# EAGLE design MotherboardThin (EAGLE 9.4.2)
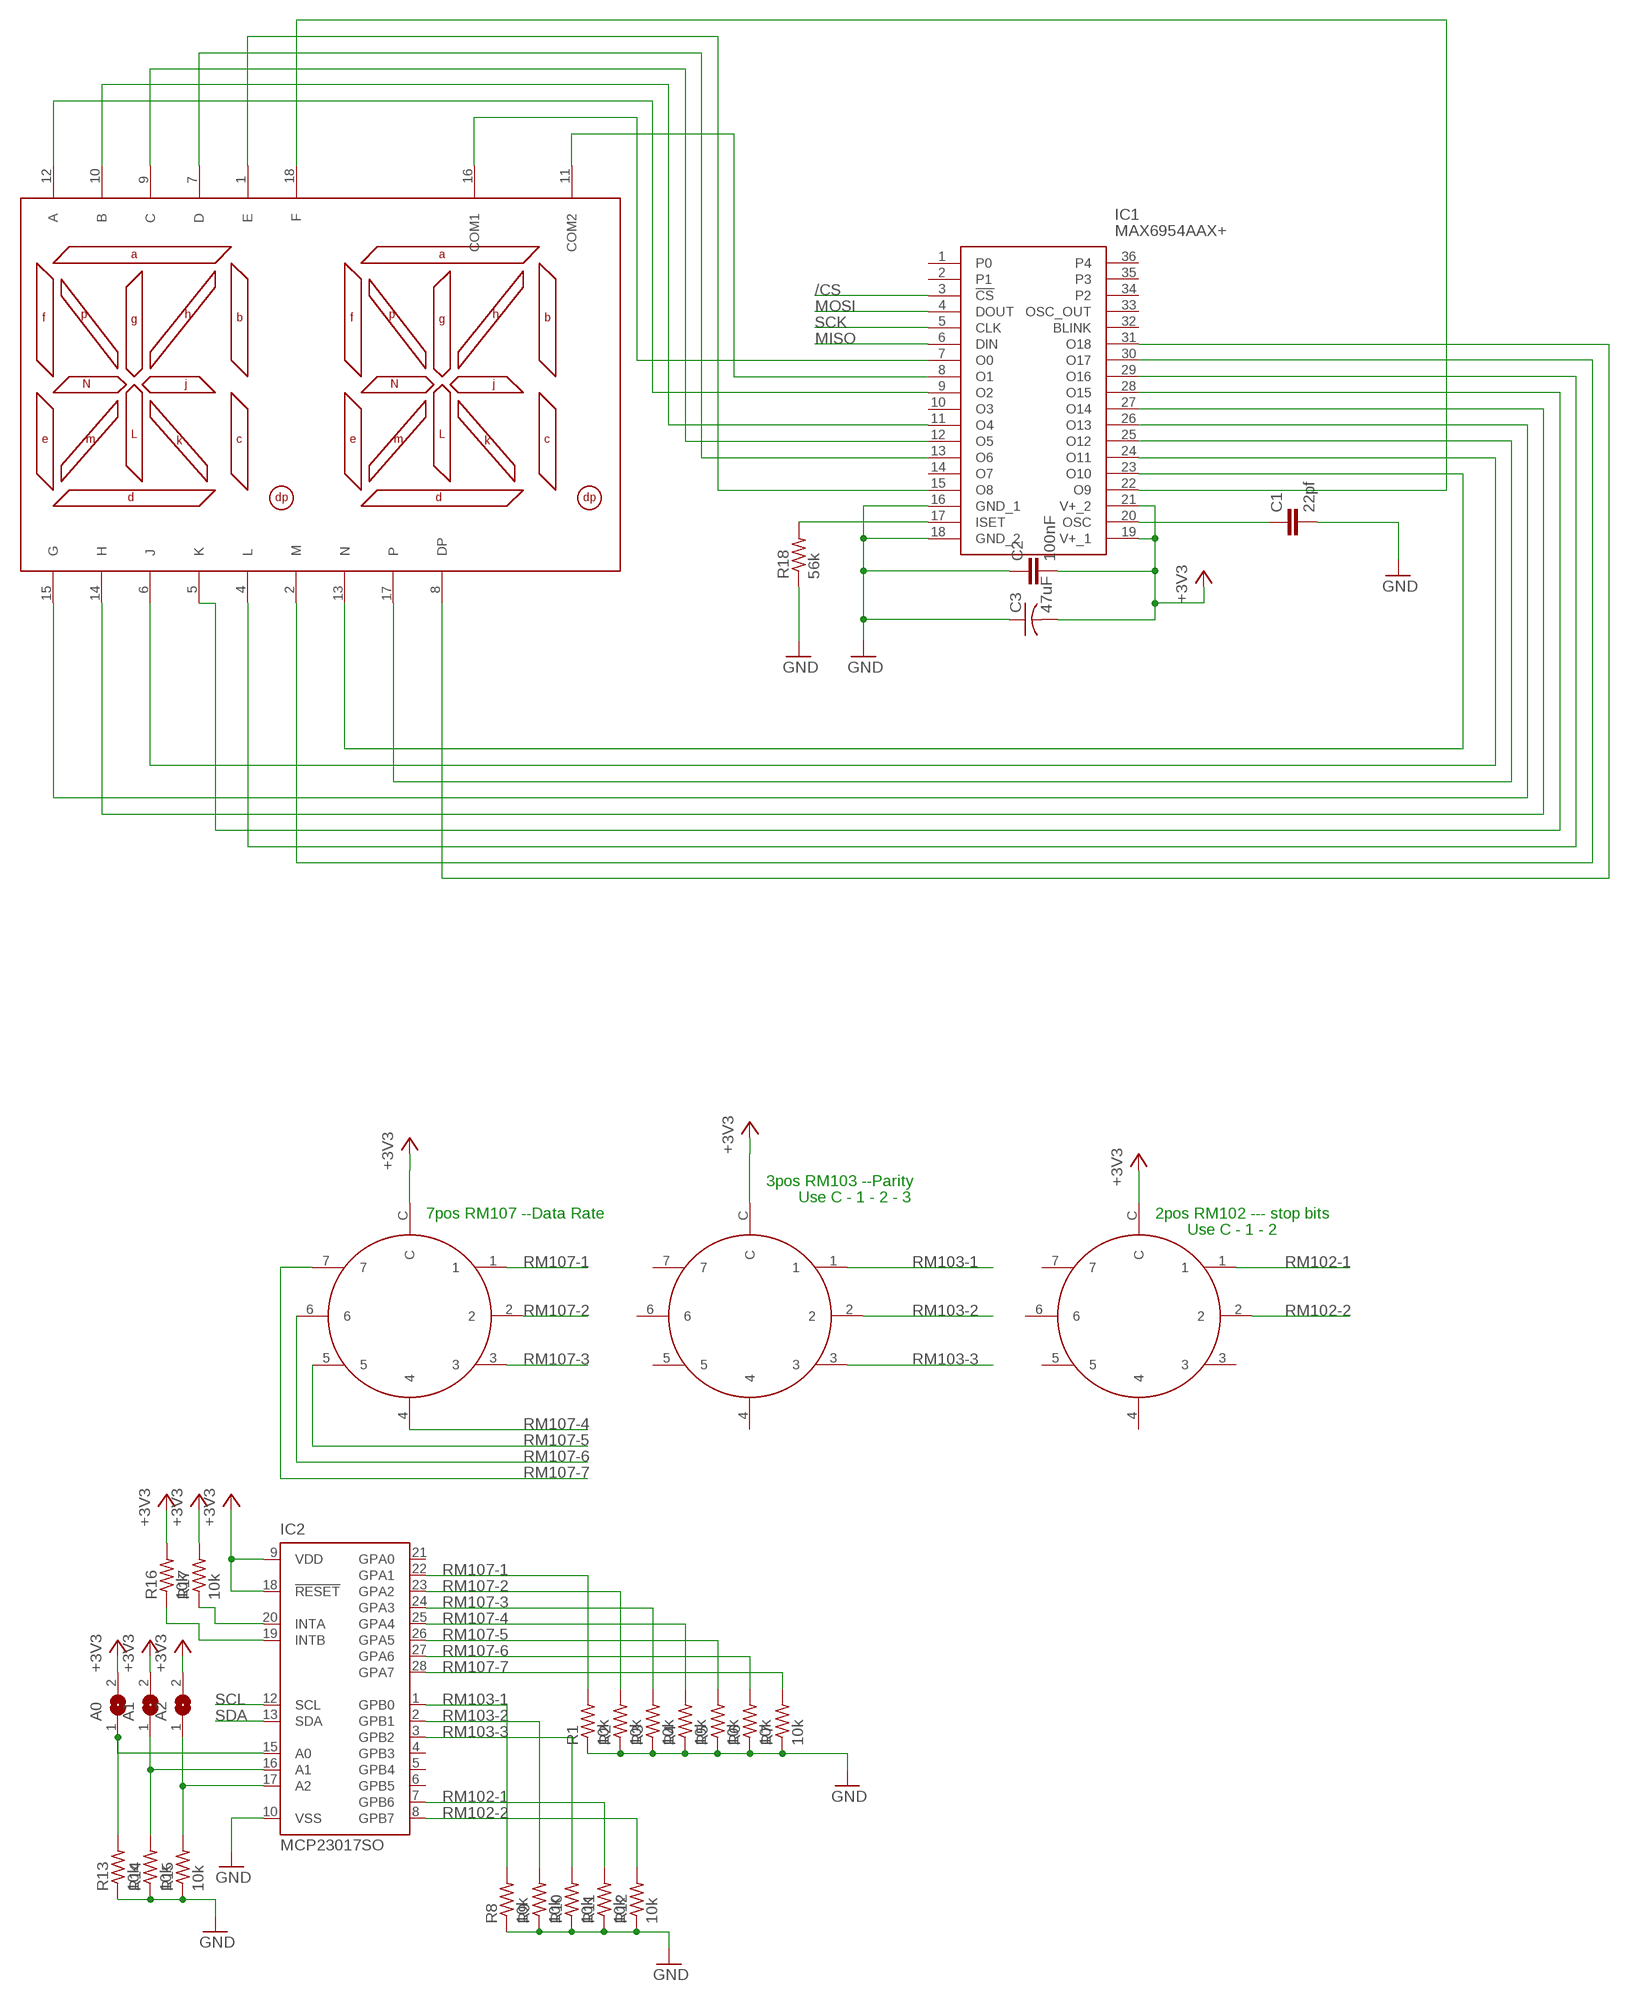
[diagram p0: schematic, sheet 1, part 1 of 2]
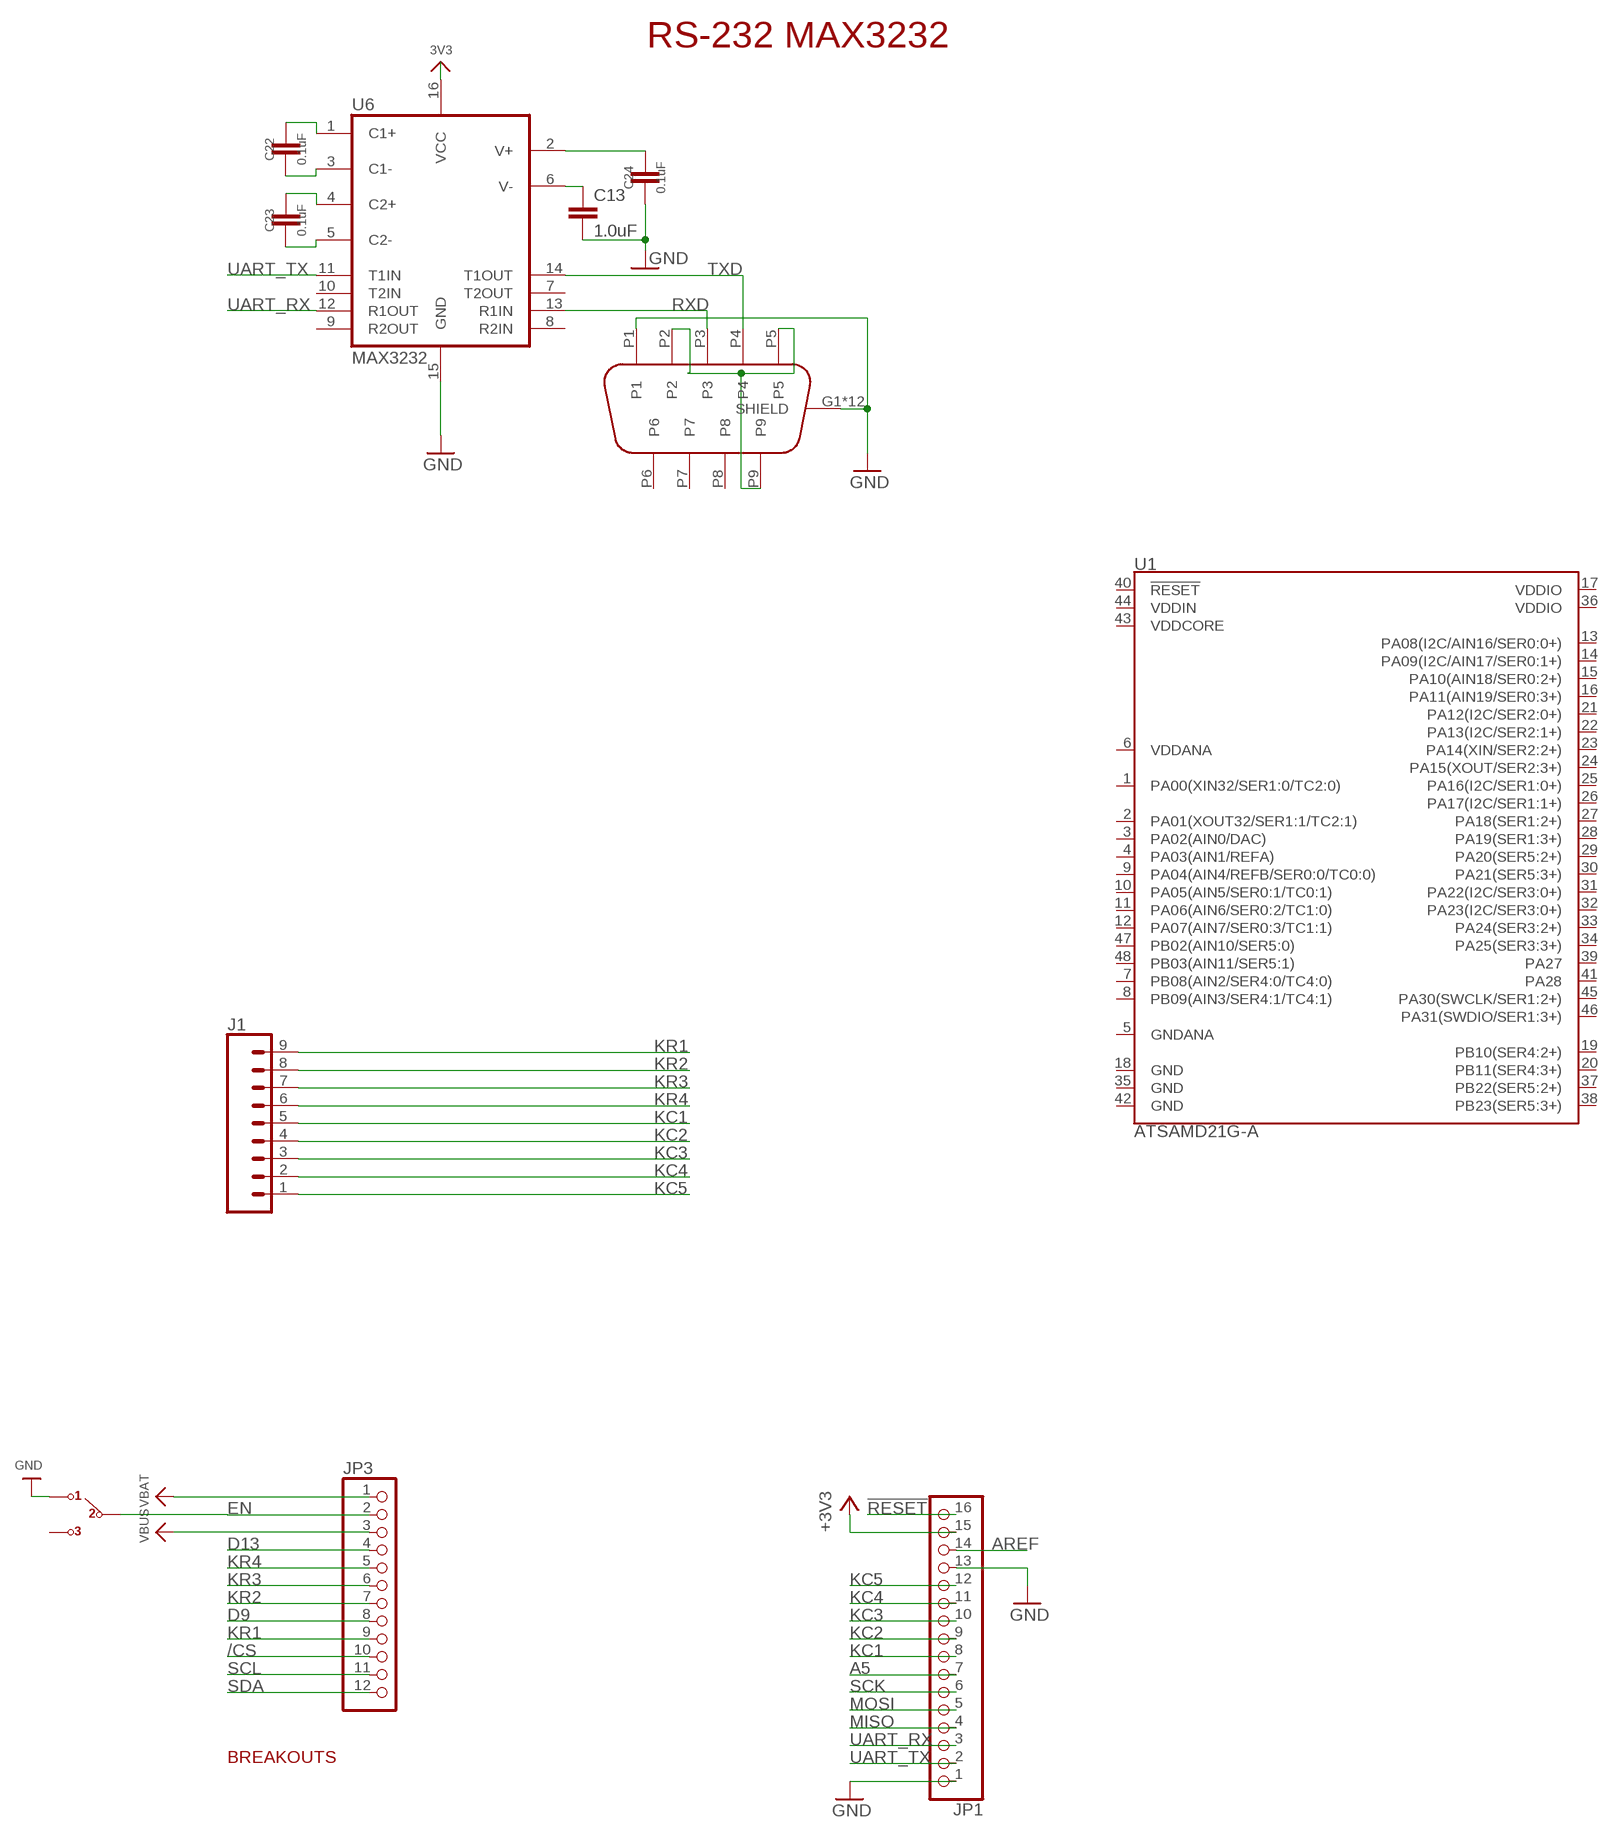
[diagram p1: schematic, sheet 1, part 2 of 2]

## Parts
A0  SJ  [SJ]
A1  SJ  [SJ]
A2  SJ  [SJ]
C1  22pf  1.0UF-0805-25V-(+80/-20%)  [0805]
C2  100nF  1.0UF-0805-25V-(+80/-20%)  [0805]
C3  47uF  C-USC1206  [C1206]
C13  1.0uF  1.0UF-0805-25V-10%  [0805]
C22  0.1uF  1.0UF-0805-25V-10%  [0805]
C23  0.1uF  1.0UF-0805-25V-10%  [0805]
C24  0.1uF  1.0UF-0805-25V-10%  [0805]
DE9FEMALE  EDGEMOUNTDE9  [DE09S065TLF]
IC1  MAX6954AAX+  [SOP80P1030X264-36N]
IC2  MCP23017SO  [SO28W]
J1  CONN_09  [1X09]
JP1  HEADER-1X16ROUND  [1X16_ROUND]
JP3  HEADER-1X12  [1X12_ROUND]
R1  10k  R-US_M0805  [M0805]
R2  10k  R-US_M0805  [M0805]
R3  10k  R-US_M0805  [M0805]
R4  10k  R-US_M0805  [M0805]
R5  10k  R-US_M0805  [M0805]
R6  10k  R-US_M0805  [M0805]
R7  10k  R-US_M0805  [M0805]
R8  10k  R-US_M0805  [M0805]
R9  10k  R-US_M0805  [M0805]
R10  10k  R-US_M0805  [M0805]
R11  10k  R-US_M0805  [M0805]
R12  10k  R-US_M0805  [M0805]
R13  10k  R-US_M0805  [M0805]
R14  10k  R-US_M0805  [M0805]
R15  10k  R-US_M0805  [M0805]
R16  10k  R-US_M0805  [M0805]
R17  10k  R-US_M0805  [M0805]
R18  56k  R-US_M0805  [M0805]
U1  ATSAMD21G-A  [TQFP-48]
U6  MAX3232  MAX2323SOIC16  [SO16]
U$1  HDSP-A27C  [DIP-18]
U$2  RM107772BCB  [RM107772BCB]
U$3  RM107772BCB  [RM107772BCB]
U$5  OS102011MA1QN1  [OS102011MA1QN1]
U$6  RM107772BCB  [RM107772BCB]

## Nets
3V3: U6.16(VCC)
!RESET: JP1.16
+3V3: A0.2 A1.2 A2.2 C2.2 C3.2 IC1.19(V+_1) IC1.21(V+_2) IC2.9(VDD) IC2.18(!RESET) JP1.15 R16.2 R17.2 U$2.C U$3.C U$6.C
/CS: IC1.3(!CS) JP3.10
A5: JP1.7
AREF: JP1.14
D9: JP3.8
D13: JP3.4
EN: JP3.2 U$5.P$2
GND: C1.2 C2.1 C3.1 C13.2 C24.2 DE9FEMALE.G1(SHIELD) DE9FEMALE.G2(SHIELD) DE9FEMALE.G3(SHIELD) DE9FEMALE.G4(SHIELD) DE9FEMALE.G5(SHIELD) DE9FEMALE.G6(SHIELD) DE9FEMALE.G7(SHIELD) DE9FEMALE.G8(SHIELD) DE9FEMALE.G9(SHIELD) DE9FEMALE.G10(SHIELD) DE9FEMALE.G11(SHIELD) DE9FEMALE.G12(SHIELD) DE9FEMALE.P1 IC1.16(GND_1) IC1.18(GND_2) IC2.10(VSS) JP1.1 JP1.13 R1.1 R2.1 R3.1 R4.1 R5.1 R6.1 R7.1 R8.1 R9.1 R10.1 R11.1 R12.1 R13.1 R14.1 R15.1 R18.1 U6.15(GND) U$5.P$1
KC1: J1.5 JP1.8
KC2: J1.4 JP1.9
KC3: J1.3 JP1.10
KC4: J1.2 JP1.11
KC5: J1.1 JP1.12
KR1: J1.9 JP3.9
KR2: J1.8 JP3.7
KR3: J1.7 JP3.6
KR4: J1.6 JP3.5
MISO: IC1.6(DIN) JP1.4
MOSI: IC1.4(DOUT) JP1.5
N$1: IC1.7(O0) U$1.16(COM1)
N$2: IC1.9(O2) U$1.12(A)
N$3: IC1.11(O4) U$1.10(B)
N$4: IC1.12(O5) U$1.9(C)
N$5: IC1.13(O6) U$1.7(D)
N$6: IC1.15(O8) U$1.1(E)
N$7: IC1.22(O9) U$1.18(F)
N$8: IC1.23(O10) U$1.13(N)
N$9: IC1.24(O11) U$1.6(J)
N$10: IC1.25(O12) U$1.17(P)
N$11: IC1.26(O13) U$1.15(G)
N$12: IC1.27(O14) U$1.14(H)
N$13: IC1.28(O15) U$1.5(K)
N$14: IC1.29(O16) U$1.4(L)
N$15: IC1.30(O17) U$1.2(M)
N$16: IC1.31(O18) U$1.8(DP)
N$17: IC1.8(O1) U$1.11(COM2)
N$18: C22.2 U6.3(C1-)
N$19: C22.1 U6.1(C1+)
N$20: C23.1 U6.4(C2+)
N$21: C23.2 U6.5(C2-)
N$22: C24.1 U6.2(V+)
N$23: C13.1 U6.6(V-)
N$24: DE9FEMALE.P2 DE9FEMALE.P5 DE9FEMALE.P9
N$25: A0.1 IC2.15(A0) R13.2
N$26: A1.1 IC2.16(A1) R14.2
N$27: A2.1 IC2.17(A2) R15.2
N$28: IC2.19(INTB) R16.1
N$29: IC2.20(INTA) R17.1
N$30: C1.1 IC1.20(OSC)
N$31: IC1.17(ISET) R18.2
RM102-1: IC2.7(GPB6) R11.2 U$6.1
RM102-2: IC2.8(GPB7) R12.2 U$6.2
RM103-1: IC2.1(GPB0) R8.2 U$3.1
RM103-2: IC2.2(GPB1) R9.2 U$3.2
RM103-3: IC2.3(GPB2) R10.2 U$3.3
RM107-1: IC2.22(GPA1) R1.2 U$2.1
RM107-2: IC2.23(GPA2) R2.2 U$2.2
RM107-3: IC2.24(GPA3) R3.2 U$2.3
RM107-4: IC2.25(GPA4) R4.2 U$2.4
RM107-5: IC2.26(GPA5) R5.2 U$2.5
RM107-6: IC2.27(GPA6) R6.2 U$2.6
RM107-7: IC2.28(GPA7) R7.2 U$2.7
RXD: DE9FEMALE.P3 U6.13(R1IN)
SCK: IC1.5(CLK) JP1.6
SCL: IC2.12(SCL) JP3.11
SDA: IC2.13(SDA) JP3.12
TXD: DE9FEMALE.P4 U6.14(T1OUT)
UART_RX: JP1.3 U6.12(R1OUT)
UART_TX: JP1.2 U6.11(T1IN)
VBAT: JP3.1
VBUS: JP3.3
Unconnected: DE9FEMALE.P6 DE9FEMALE.P7 DE9FEMALE.P8 IC1.1(P0) IC1.2(P1) IC1.10(O3) IC1.14(O7) IC1.32(BLINK) IC1.33(OSC_OUT) IC1.34(P2) IC1.35(P3) IC1.36(P4) IC2.4(GPB3) IC2.5(GPB4) IC2.6(GPB5) IC2.21(GPA0) U1.1(PA00(XIN32/SER1:0/TC2:0)) U1.2(PA01(XOUT32/SER1:1/TC2:1)) U1.3(PA02(AIN0/DAC)) U1.4(PA03(AIN1/REFA)) U1.5(GNDANA) U1.6(VDDANA) U1.7(PB08(AIN2/SER4:0/TC4:0)) U1.8(PB09(AIN3/SER4:1/TC4:1)) U1.9(PA04(AIN4/REFB/SER0:0/TC0:0)) U1.10(PA05(AIN5/SER0:1/TC0:1)) U1.11(PA06(AIN6/SER0:2/TC1:0)) U1.12(PA07(AIN7/SER0:3/TC1:1)) U1.13(PA08(I2C/AIN16/SER0:0+)) U1.14(PA09(I2C/AIN17/SER0:1+)) U1.15(PA10(AIN18/SER0:2+)) U1.16(PA11(AIN19/SER0:3+)) U1.17(VDDIO) U1.18(GND) U1.19(PB10(SER4:2+)) U1.20(PB11(SER4:3+)) U1.21(PA12(I2C/SER2:0+)) U1.22(PA13(I2C/SER2:1+)) U1.23(PA14(XIN/SER2:2+)) U1.24(PA15(XOUT/SER2:3+)) U1.25(PA16(I2C/SER1:0+)) U1.26(PA17(I2C/SER1:1+)) U1.27(PA18(SER1:2+)) U1.28(PA19(SER1:3+)) U1.29(PA20(SER5:2+)) U1.30(PA21(SER5:3+)) U1.31(PA22(I2C/SER3:0+)) U1.32(PA23(I2C/SER3:0+)) U1.33(PA24(SER3:2+)) U1.34(PA25(SER3:3+)) U1.35(GND) U1.36(VDDIO) U1.37(PB22(SER5:2+)) U1.38(PB23(SER5:3+)) U1.39(PA27) U1.40(!RESET!) U1.41(PA28) U1.42(GND) U1.43(VDDCORE) U1.44(VDDIN) U1.45(PA30(SWCLK/SER1:2+)) U1.46(PA31(SWDIO/SER1:3+)) U1.47(PB02(AIN10/SER5:0)) U1.48(PB03(AIN11/SER5:1)) U6.7(T2OUT) U6.8(R2IN) U6.9(R2OUT) U6.10(T2IN) U$3.4 U$3.5 U$3.6 U$3.7 U$5.CASE1(CASE) U$5.CASE2(CASE) U$5.P$3 U$6.3 U$6.4 U$6.5 U$6.6 U$6.7

## Notes on the sheet
- RS-232 MAX3232
- 3pos RM103 --Parity
- Use C - 1 - 2 - 3
- 7pos RM107 --Data Rate | 2pos RM102 --- stop bits
- Use C - 1 - 2
- BREAKOUTS

## Library data of the parts
A0 A1 A2 = jumper:SJ: SMD solder JUMPER
C1 C2 = SparkFun-Capacitors:1.0UF: 1µF ceramic capacitors A capacitor is a passive two-terminal electrical component used to store electrical energy temporarily in an electric field.; PROD_ID: CAP-11625; VALUE: 1.0uF
C3 = adafruit:C-US: CAPACITOR, American symbol
C13 = SparkFun-Capacitors:1.0UF: 1µF ceramic capacitors A capacitor is a passive two-terminal electrical component used to store electrical energy temporarily in an electric field.; PROD_ID: CAP-08064
C22-C24 = SparkFun-Capacitors:1.0UF: 1µF ceramic capacitors A capacitor is a passive two-terminal electrical component used to store electrical energy temporarily in an electric field.; PROD_ID: CAP-08064; VALUE: 1.0uF
DE9FEMALE = Serial:EDGEMOUNTDE9
IC1 = SamacSys_Parts:MAX6954AAX+: MAX6954AAX+, LED Display Driver, 16-Digits 128-Segments, 2.7 5.5 V, 36-Pin SSOP Source: Datasheet <https://componentsearchengine.com/Datasheets/1/MAX6954AAX .pdf>; DESCRIPTION: MAX6954AAX+, LED Display Driver, 16-Digits 128-Segments, 2.7 5.5 V, 36-Pin SSOP; HEIGHT: 2.64mm; MANUFACTURER_NAME: Maxim Integrated; MANUFACTURER_PART_NUMBER: MAX6954AAX+; MOUSER_PART_NUMBER: 700-MAX6954AAX; MOUSER_PRICE-STOCK: https://www.mouser.com/Search/Refine.aspx?Keyword=700-MAX6954AAX
IC2 = adafruit:MCP23017: http://ww1.microchip.com/downloads/en/DeviceDoc/21952a.pdf Source: http://ww1.microchip.com/downloads/en/DeviceDoc/21952a.pdf
J1 = SparkFun-Connectors:CONN_09: Multi connection point. Often used as Generic Header-pin footprint for 0.1 inch spaced/style header connections On any of the 0.1 inch spaced packages, you can populate with these: Break Away Headers - Straight <https://www.sparkfun.com/products/116> (PRT-00116) Break Away Male Headers - Right Angle <https://www.sparkfun.com/products/553> (PRT-00553) Female Headers <https://www.sparkfun.com/products/115> (PRT-00115) Break Away Headers - Machine Pin <https://www.sparkfun.com/products/117> (PRT-00117) Break Away Female Headers - Swiss Machine Pin <https://www.sparkfun.com/products/743> (PRT-00743) For SCREWTERMINALS and SPRING TERMINALS visit here: Screw Terimnals on SparkFun.com <https://www.sparkfun.com/search/results?term=Screw+Terminals> (5mm/3.5mm/2.54mm spacing) This device is also useful as a general connection point to wire up your design to another part of your project. Our various solder wires solder well into these plated through hole pads. Hook-Up Wire - Assortment (Stranded, 22 AWG) <https://www.sparkfun.com/products/11375> (PRT-11375) Hook-Up Wire - Assortment (Solid Core, 22 AWG) <https://www.sparkfun.com/products/11367> (PRT-11367) View the entire wire category on our website here <https://www.sparkfun.com/categories/141> Special notes: Molex polarized connector foot print use with SKU : PRT-08231 with associated crimp pins and housings. 1MM SMD Version SKU: PRT-10208 NOTES ON THE VARIANTS LOCK and LOCK_LONGPADS... This footprint was designed to help hold the alignment of a through-hole component (i.e. 6-pin header) while soldering it into place. You may notice that each hole has been shifted either up or down by 0.005 of an inch from it's more standard position (which is a perfectly straight line). This slight alteration caused the pins (the squares in the middle) to touch the edges of the holes. Because they are alternating, it causes a "brace" to hold the component in place. 0.005 has proven to be the perfect amount of "off-center" position when using our standard breakaway headers. Although looks a little odd when you look at the bare footprint, once you have a header in there, the alteration is very hard to notice. Also,if you push a header all the way into place, it is covered up entirely on the bottom side.
JP1 = microbuilder:HEADER-1X16: PIN HEADER
JP3 = microbuilder:HEADER-1X12
R1-R18 = resistor:R-US_: RESISTOR, American symbol
U1 = SparkFun-IC-Microcontroller:ATSAMD21G: Atmel SAMD21G SMART ARM-Based Microcontroller The Atmel ® | SMART ™ SAM D21 is a series of low-power microcontrollers using the 32-bit ARM ® Cortex ® -M0+ processor, and ranging from 32- to 64-pins with up to 256KB Flash and 32KB of SRAM. The SAM D21 devices operate at a maximum frequency of 48MHz and reach 2.46 CoreMark/MHz. They are designed for simple and intuitive migration with identical peripheral modules, hex compatible code, identical linear address map and pin compatible migration paths between all devices in the product series. All devices include intelligent and flexible peripherals, Atmel Event System for inter-peripheral signaling, and support for capacitive touch button, slider and wheel user interfaces. Datasheet <https://cdn.sparkfun.com/datasheets/Dev/Arduino/Boards/Atmel-42181-SAM-D21_Datasheet.pdf> SparkFun Products SparkFun SAMD21 Mini Breakout <https://www.sparkfun.com/products/13664> (DEV-13664) SparkFun SAMD21 Dev Breakout <https://www.sparkfun.com/products/13672> (DEV-13672); PROD_ID: IC-13064
U6 = SparkFun-IC-Comms:MAX2323: RS232 Transceiver This part covers 232 drivers that are compatible with the MAX3232. Sipex SP3232EB Datasheet <http://cdn.sparkfun.com/datasheets/Components/General%20IC/SP3232EBCA-L.pdf> SparkFun Products SOIC component <https://www.sparkfun.com/products/589> (COM-00589 / IC-08171) Retired DIP component (COM-00316 / IC-08446) SparkFun Transceiver Breakout - MAX3232 <https://www.sparkfun.com/products/11189> (BOB-11189) SparkFun XBee Explorer Serial <https://www.sparkfun.com/products/13225> (WRL-13225); PROD_ID: IC-08171
U$1 = Segment displays:HDSP-A27C
U$2 U$3 U$6 = Segment displays:RM107772BCB
U$5 = FPC:OS102011MA1QN1

## Board
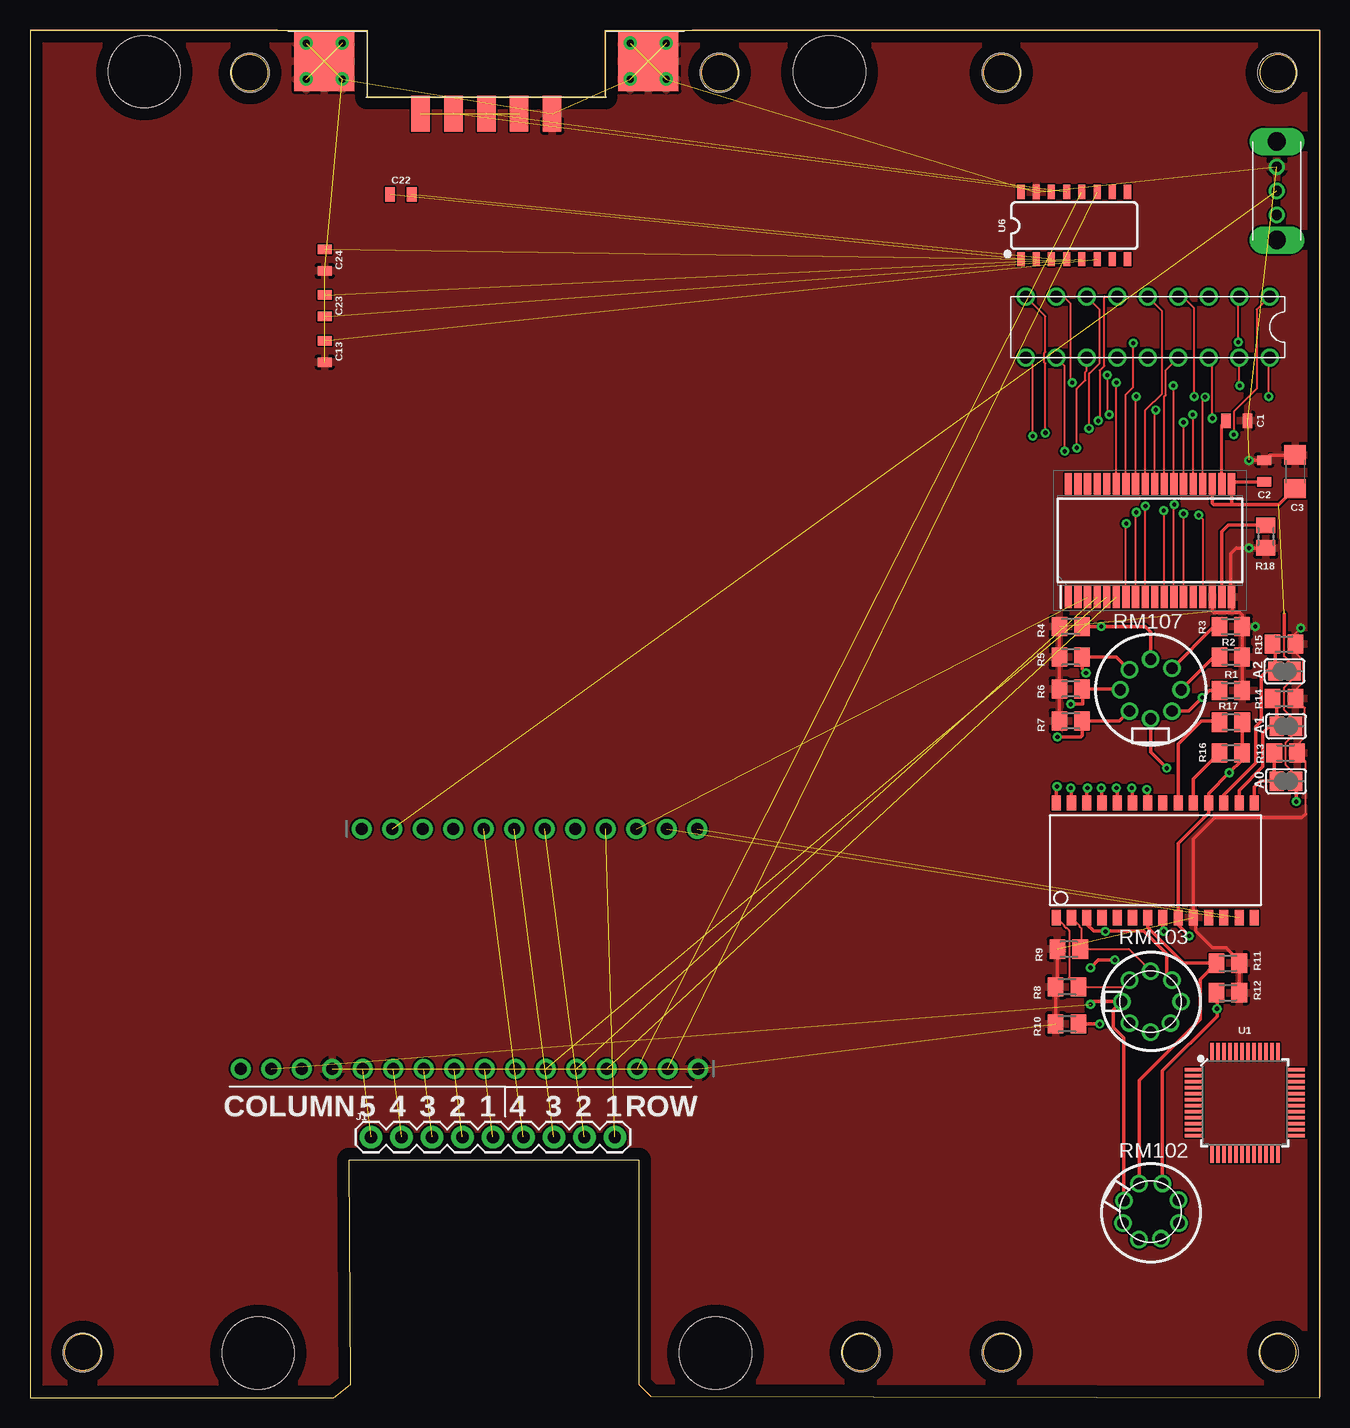
[diagram p2: board, top side]
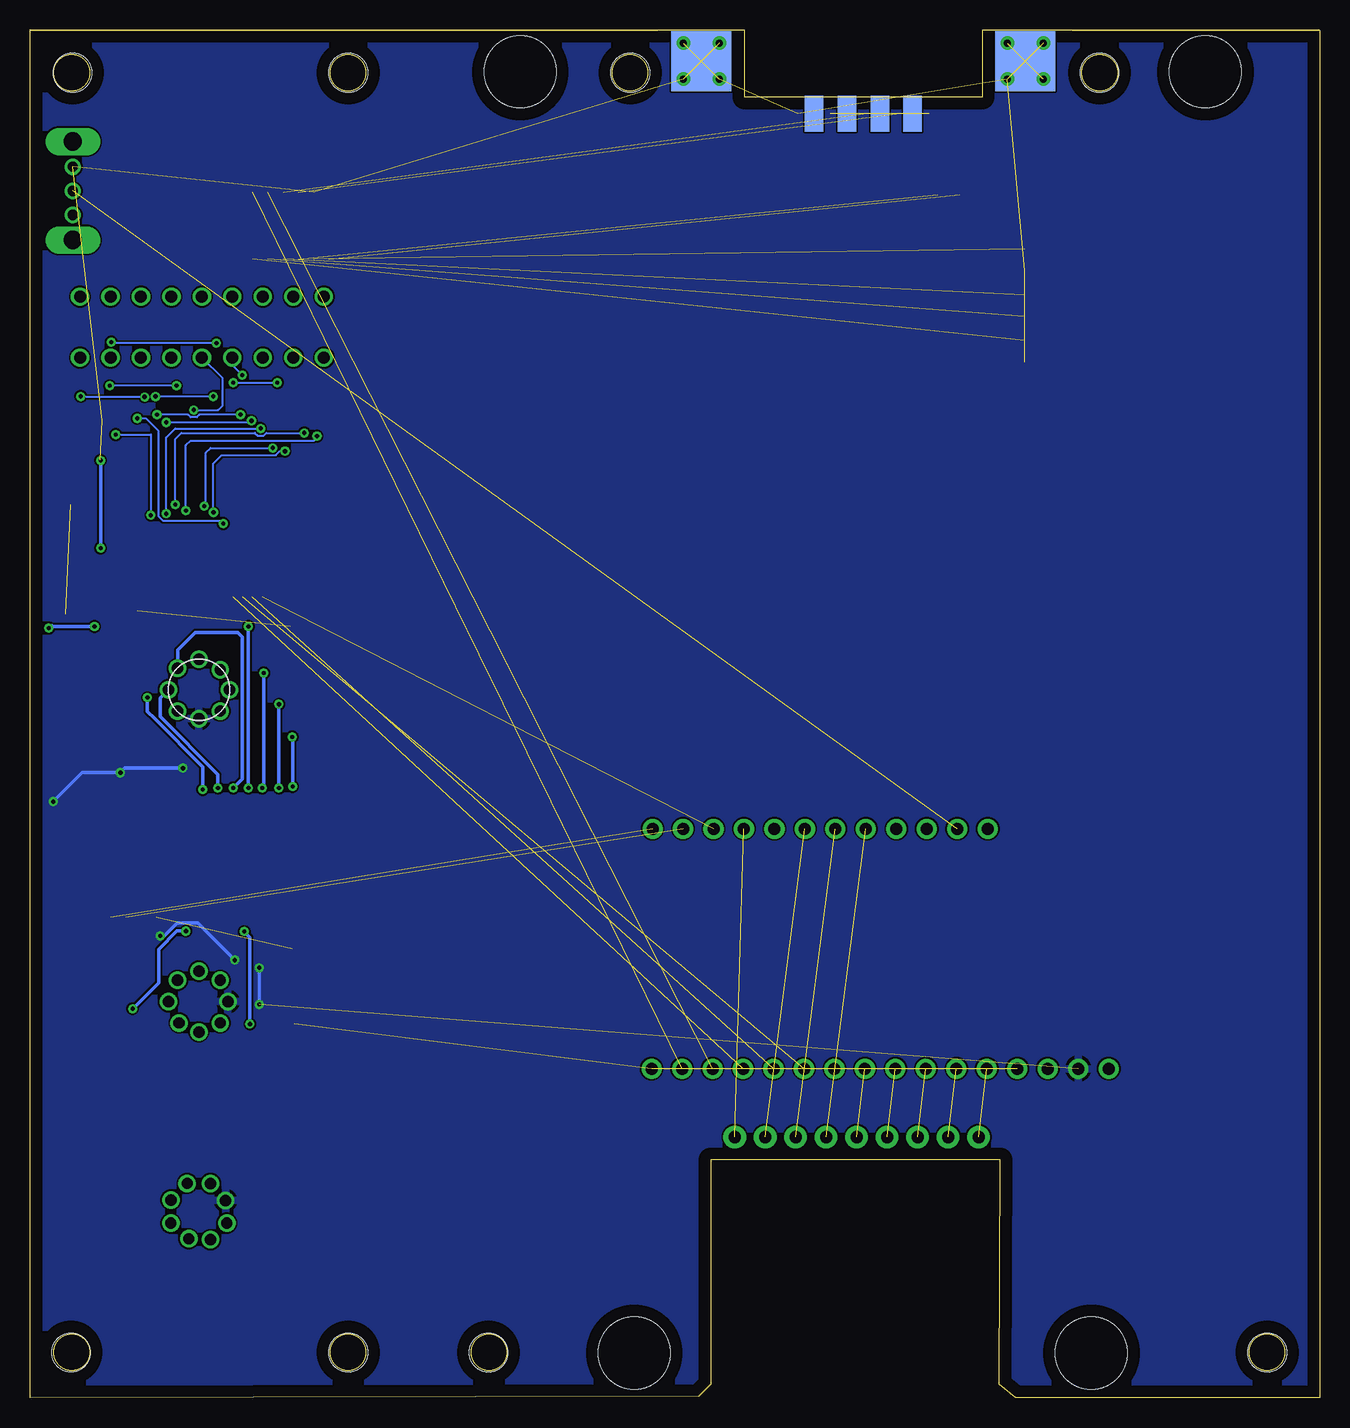
[diagram p3: board, bottom side, seen from below]

Size 107.47 x 114 mm. Coordinates in mm from the lower left corner, seen from the top.
Outline: 0,0 4.21,0 25.31,0 26.72,1.11 26.62,19.81 50.62,19.81 50.72,19.81 50.72,1.11 51.72,0.11 107.47,0 107.47,114 55.17,114 47.93,114 47.93,108.41 28.12,108.41 28.12,114 20.62,114 0,114 0,0
Outline: circle at 4.39,3.76 radius 1.5
Outline: circle at 69.22,3.76 radius 1.5
Outline: circle at 80.97,110.44 radius 1.5
Outline: circle at 104,110.44 radius 1.5
Outline: circle at 80.97,3.76 radius 1.5
Outline: circle at 104,3.76 radius 1.5
Outline: circle at 18.32,110.44 radius 1.5
Outline: circle at 57.47,110.44 radius 1.5
Copper layers (1*16): Top 0.035mm / dielectric 1.5mm / Bottom 0.035mm
Design rules "default": minimum track width 6mil, minimum drill 0.35mm, track to track 6mil, track to pad 6mil, pad to pad 6mil, via to via 6mil, smd to smd 6mil, copper to edge 40mil, drill to drill 6mil, minimum pad ring 10mil, minimum via ring 8mil, stop-mask expansion 4mil, vias tented up to drill 0mil, thermal gap 10mil
Holes 3.2 mm at 18.34,110.44 57.45,110.44 80.95,110.44 103.94,110.44 104.06,3.76 80.95,3.76 69.26,3.76 4.37,3.76
Holes 6 mm at 9.52,110.51 66.62,110.51 19.02,3.71 57.12,3.71
Milling: 8 lines

### Footprints (pad centres in the part's own frame; a part is rotated, then mirrored left to right if it is on the bottom)
SJ = smd 1.168 x 1.6: 1 -0.762,0; 2 0.762,0
0805 = smd 0.8 x 1.2: 1 -0.9,0; 2 0.9,0
C1206 = smd 1.6 x 1.8: 1 -1.4,0; 2 1.4,0
DE09S065TLF = drill 0.6: G1 -15,4.5; G2 -12,4.5; G3 -15,1.5; G4 -12,1.5; G5 12,4.5; G6 15,4.5; G7 12,1.5; G8 15,1.5 | smd 5 x 5 bottom: G9 13.5,3; G10 -13.5,3 | smd 5 x 5: G11 -13.5,3; G12 13.5,3 | smd 1.54 x 3: P1 5.48,-1.37; P2 2.74,-1.37; P3 0,-1.37; P4 -2.74,-1.37; P5 -5.48,-1.37 | smd 1.54 x 3 bottom: P6 4.11,-1.37; P7 1.37,-1.37; P8 -1.37,-1.37; P9 -4.11,-1.37
SOP80P1030X264-36N = smd 1.8 x 0.6: 1 -4.725,6.8; 2 -4.725,6; 3 -4.725,5.2; 4 -4.725,4.4; 5 -4.725,3.6; 6 -4.725,2.8; 7 -4.725,2; 8 -4.725,1.2; 9 -4.725,0.4; 10 -4.725,-0.4; 11 -4.725,-1.2; 12 -4.725,-2; 13 -4.725,-2.8; 14 -4.725,-3.6; 15 -4.725,-4.4; 16 -4.725,-5.2; 17 -4.725,-6; 18 -4.725,-6.8; 19 4.725,-6.8; 20 4.725,-6; 21 4.725,-5.2; 22 4.725,-4.4; 23 4.725,-3.6; 24 4.725,-2.8; 25 4.725,-2; 26 4.725,-1.2; 27 4.725,-0.4; 28 4.725,0.4; 29 4.725,1.2; 30 4.725,2; 31 4.725,2.8; 32 4.725,3.6; 33 4.725,4.4; 34 4.725,5.2; 35 4.725,6; 36 4.725,6.8
SO28W = smd 0.762 x 1.27: 1 -7.62,-4.78; 2 -6.35,-4.78; 3 -5.08,-4.78; 4 -3.81,-4.78; 5 -2.54,-4.78; 6 -1.27,-4.78; 7 0,-4.78; 8 1.27,-4.78; 9 2.54,-4.78; 10 3.81,-4.78; 11 5.08,-4.78; 12 6.35,-4.78; 13 7.62,-4.78; 14 8.89,-4.78; 15 8.89,4.78; 16 7.62,4.78; 17 6.35,4.78; 18 5.08,4.78; 19 3.81,4.78; 20 2.54,4.78; 21 1.27,4.78; 22 0,4.78; 23 -1.27,4.78; 24 -2.54,4.78; 25 -3.81,4.78; 26 -5.08,4.78; 27 -6.35,4.78; 28 -7.62,4.78
1X09 = drill 1.016 pad 1.88: 1 0,0; 2 2.54,0; 3 5.08,0; 4 7.62,0; 5 10.16,0; 6 12.7,0; 7 15.24,0; 8 17.78,0; 9 20.32,0
1X16_ROUND = drill 1 pad 1.676: 1 -19.05,0; 2 -16.51,0; 3 -13.97,0; 4 -11.43,0; 5 -8.89,0; 6 -6.35,0; 7 -3.81,0; 8 -1.27,0; 9 1.27,0; 10 3.81,0; 11 6.35,0; 12 8.89,0; 13 11.43,0; 14 13.97,0; 15 16.51,0; 16 19.05,0
1X12_ROUND = drill 1 pad 1.676: 1 -13.97,0; 2 -11.43,0; 3 -8.89,0; 4 -6.35,0; 5 -3.81,0; 6 -1.27,0; 7 1.27,0; 8 3.81,0; 9 6.35,0; 10 8.89,0; 11 11.43,0; 12 13.97,0
M0805 = smd 1.3 x 1.6: 1 -0.95,0; 2 0.95,0
TQFP-48 = smd 1.5 x 0.28: 1 -4.25,2.75; 2 -4.25,2.25; 3 -4.25,1.75; 4 -4.25,1.25; 5 -4.25,0.75; 6 -4.25,0.25; 7 -4.25,-0.25; 8 -4.25,-0.75; 9 -4.25,-1.25; 10 -4.25,-1.75; 11 -4.25,-2.25; 12 -4.25,-2.75; 25 4.25,-2.75; 26 4.25,-2.25; 27 4.25,-1.75; 28 4.25,-1.25; 29 4.25,-0.75; 30 4.25,-0.25; 31 4.25,0.25; 32 4.25,0.75; 33 4.25,1.25; 34 4.25,1.75; 35 4.25,2.25; 36 4.25,2.75 | smd 0.28 x 1.5: 13 -2.75,-4.25; 14 -2.25,-4.25; 15 -1.75,-4.25; 16 -1.25,-4.25; 17 -0.75,-4.25; 18 -0.25,-4.25; 19 0.25,-4.25; 20 0.75,-4.25; 21 1.25,-4.25; 22 1.75,-4.25; 23 2.25,-4.25; 24 2.75,-4.25; 37 2.75,4.25; 38 2.25,4.25; 39 1.75,4.25; 40 1.25,4.25; 41 0.75,4.25; 42 0.25,4.25; 43 -0.25,4.25; 44 -0.75,4.25; 45 -1.25,4.25; 46 -1.75,4.25; 47 -2.25,4.25; 48 -2.75,4.25
SO16 = smd 0.6 x 1.2: 1 -4.445,-2.8; 2 -3.175,-2.8; 3 -1.905,-2.8; 4 -0.635,-2.8; 5 0.635,-2.8; 6 1.905,-2.8; 7 3.175,-2.8; 8 4.445,-2.8; 9 4.445,2.8; 10 3.175,2.8; 11 1.905,2.8; 12 0.635,2.8; 13 -0.635,2.8; 14 -1.905,2.8; 15 -3.175,2.8; 16 -4.445,2.8
DIP-18 = drill 1: 1 7.62,2.54; 2 5.08,2.54; 3 2.54,2.54; 4 0,2.54; 5 -2.54,2.54; 6 -5.08,2.54; 7 -7.62,2.54; 8 -10.16,2.54; 9 -12.7,2.54; 10 -12.7,-2.54; 11 -10.16,-2.54; 12 -7.62,-2.54; 13 -5.08,-2.54; 14 -2.54,-2.54; 15 0,-2.54; 16 2.54,-2.54; 17 5.08,-2.54; 18 7.62,-2.54
RM107772BCB = drill 0.95: 1 1.778,1.778; 2 2.54,0; 3 1.778,-1.778; 4 0,-2.54; 5 -1.778,-1.651; 6 -2.54,0; 7 -1.778,1.778; C 0,2.413
OS102011MA1QN1 = drill 1.524 pad 2 long: CASE1 0,0; CASE2 8.204,0 | drill 0.85 pad 1.27: P$1 2.108,0; P$2 4.115,0; P$3 6.121,0

### Placement (x,y rotation side)
A0  104.67,51.38 0 top
A1  104.67,55.97 0 top
A2  104.55,60.55 0 top
C1  100.57,81.42 0 top
C2  102.86,77.23 270 top
C3  105.42,77.18 270 top
C13  24.56,87.2 270 top
C22  30.91,100.28 0 top
C23  24.56,91.01 270 top
C24  24.56,94.82 270 top
DE9FEMALE  38.02,108.41 0 top
IC1  93.33,71.45 90 top
IC2  93.14,44.79 0 top
J1  28.42,21.71 0 top
JP1  36.62,27.41 180 top
JP3  41.62,47.41 0 top
R1  100.06,58.94 180 top
R2  100.06,61.74 180 top
R3  100.06,64.28 180 top
R4  86.73,64.28 0 top
R5  86.73,61.74 0 top
R6  86.73,59.07 0 top
R7  86.73,56.4 0 top
R8  86.42,34.23 0 top
R9  86.57,37.38 0 top
R10  86.42,31.15 0 top
R11  99.82,36.21 180 top
R12  99.82,33.75 180 top
R13  104.63,53.73 180 top
R14  104.51,58.27 180 top
R15  104.51,62.81 180 top
R16  100.06,53.73 0 top
R17  100.07,56.29 0 top
R18  102.98,71.77 90 top
U1  101.24,24.57 0 top
U6  87.02,97.7 0 top
U$1  95.68,89.23 0 top
U$2  93.39,59 180 bottom
U$3  93.39,33 90 top
U$5  103.9,104.7 270 top
U$6  93.39,15.5 67.5 top

### Tracks (layer width: path | path; a pad name or v marks a point on that pad's centre or on a via)
+3V3  (via drill 0.35)  (2 unrouted)
  Top 0.152: 104.51,64.28 104.51,63.39 104.51,61.79 105.11,61.19 105.11,60.76 A2.2 105.11,60.35 105.11,59.78 104.51,59.19 104.51,57.33 105.11,56.73 105.11,56.3 A1.2 105.11,55.64 105.11,55.07 104.63,54.6 104.63,52.75 105.11,52.27 105.11,51.71 A0.2
  Top 0.305: IC1.21 98.53,74.57 98.67,74.44 100.06,74.44 | 100.06,74.44 104.07,74.44 C3.2 | C2.2 100.28,76.33 IC1.19 100.13,74.51 100.06,74.44 | R17.2 101.01,56.28 R16.2 101.01,53.16 v99.94,52.08 98.22,50.37 IC2.18 98.22,48.72 95.68,46.18 IC2.9 95.68,39.4 v96.61,38.47 | U$2.C 93.39,53.8 v94.73,52.47 | v105.52,49.67 105.52,51.29 A0.2 | v88.38,32.78 88.6,33 U$3.C 90.28,32.31 90.28,30.88 91.17,29.99 U$6.C | v88.38,35.83 89.01,36.46 v90.41,36.46 | 104.51,63.39 104.51,65.29
  Bottom 0.305: v94.73,52.47 99.55,52.47 v99.94,52.08 103.11,52.08 v105.52,49.67 | v88.38,32.78 v88.38,35.83 | v96.61,38.47 96.29,38.47 95.2,39.56 93.51,39.56 v90.41,36.46
  pour Bottom: 0.24,114.06 28.18,114.06 28.18,108.34 47.86,108.34 47.86,113.81 107.56,113.81 107.56,0.01 51.93,0.01 50.79,1.16 50.79,19.57 50.66,19.7 26.66,19.7 26.66,1.41 25.26,0.01 0.11,0.01 0.11,113.93
/CS  (1 unrouted)
EN  (1 unrouted)
GND  (via drill 0.35)  (22 unrouted)
  Top 0.152: v105.9,64.15 105.46,63.7 R15.1 105.46,62.11 106.12,61.45 106.12,59.66 105.46,58.99 R14.1 106.25,57.48 106.25,55.07 105.58,54.41 R13.1 106.3,53.02 106.3,48.66
  Top 0.305: IC1.16 98.54,65.55 98.67,65.42 100.19,65.42 | R3.1 101.01,65.23 100.82,65.42 100.19,65.42 | 100.19,65.42 100.19,66.67 IC1.18 100.06,66.8 100.06,70.37 100.51,70.82 v101.59,70.82 R18.1 | R3.1 R2.1 R1.1 | R7.1 R6.1 R5.1 R4.1 | R9.1 85.62,34.38 R8.1 R10.1 | R12.1 R11.1 100.77,36.39 99.68,37.48 98.56,37.48 97.14,38.9 97.14,39.82 IC2.10 96.95,46.56 98.73,48.34 | 98.73,48.34 98.79,48.4 | R3.1 v102.09,64.28 | C3.1 103.31,78.58 C2.1 v101.6,78.13 v101.59,78.12 | 98.73,48.34 105.98,48.34 106.3,48.66
  Bottom 0.152: v105.9,64.15 105.88,64.15 105.62,64.41
  Bottom 0.305: v102.09,64.28 105.78,64.28 v105.9,64.15 | v101.59,70.82 v101.59,78.12
  pour Top: 0.11,114.06 28.18,114.06 28.18,107.71 47.99,107.71 47.99,113.81 107.56,113.81 107.56,0.01 51.93,0.01 50.79,1.16 50.79,19.7 26.66,19.7 26.66,1.16 25.51,0.01 -0.01,0.01 -0.01,113.93
KC1  (1 unrouted)
KC2  (1 unrouted)
KC3  (1 unrouted)
KC4  (1 unrouted)
KC5  (1 unrouted)
KR1  (1 unrouted)
KR2  (1 unrouted)
KR3  (1 unrouted)
KR4  (1 unrouted)
MISO  (1 unrouted)
MOSI  (1 unrouted)
N$1  (via drill 0.35)
  Top 0.152: IC1.7 91.33,72.75 91.3,72.78 v91.36,72.85 | v98.54,81.63 98.54,86.37 U$1.16
  Bottom 0.152: v91.36,72.85 91.58,73.07 96.38,73.07 96.76,73.45 96.76,80.55 97.84,81.63 v98.54,81.63
N$2  (via drill 0.35)
  Top 0.152: IC1.9 92.93,74.29 v92.95,74.31 | v87.23,79.16 87.23,84.09 87.95,84.8 87.95,85.48 88.06,85.6 U$1.12
  Bottom 0.152: v92.95,74.31 92.82,74.44 92.82,78.75 92.41,79.16 v87.23,79.16
N$3  (via drill 0.35)
  Top 0.152: IC1.11 94.53,73.87 v94.47,73.93 | v83.55,80.15 83.55,86.12 U$1.10
  Bottom 0.152: v94.47,73.93 94.47,79.39 94.09,79.77 83.81,79.77 83.55,80.02 v83.55,80.15
N$4  (via drill 0.35)
  Top 0.152: IC1.12 95.33,74.41 v95.36,74.44 | U$1.9 84.62,90.13 84.62,87.18 84.54,87.1 84.54,86.28 84.62,86.2 v84.62,80.41
  Bottom 0.152: v84.62,80.41 87.77,80.41 88,80.18 88.5,80.18 88.73,80.41 94.86,80.41 95.36,79.9 v95.36,74.44
N$5  (via drill 0.35)
  Top 0.152: IC1.13 96.13,73.67 v96.12,73.67 | v88.25,80.79 88.25,85.36 89.14,86.25 89.14,90.69 U$1.7
  Bottom 0.152: v96.12,73.67 96.12,80.02 95.36,80.79 v88.25,80.79
N$6  (via drill 0.35)
  Top 0.152: U$1.1 102.22,90.69 102.22,84.09 100.32,82.18 v100.32,80.28 | v97.4,73.55 97.73,73.21 IC1.15
  Bottom 0.152: v100.32,80.28 97.4,80.28 v97.4,73.55
N$7  (via drill 0.35)
  Top 0.152: IC1.22 97.73,83.22 v97.92,83.41 | v103.24,83.45 103.24,86.63 U$1.18
  Bottom 0.152: v97.92,83.41 103.19,83.41 v103.24,83.45
N$8  (via drill 0.35)
  Top 0.152: v89.78,85.23 89.78,82.08 v89.93,81.93 | v96.89,81.93 96.89,76.22 IC1.23
  Bottom 0.152: U$1.13 90.6,86.06 v89.78,85.23 | v89.93,81.93 93.36,81.93 93.57,81.72 94.08,81.72 94.29,81.93 v96.89,81.93
N$9  (via drill 0.35)
  Top 0.152: IC1.24 96.13,81.29 v96.12,81.29 | v89.01,81.42 89.14,81.55 89.14,85.62 89.51,85.99 89.52,85.98 89.52,91.77 U$1.6
  Bottom 0.152: v96.12,81.29 89.14,81.29 v89.01,81.42
N$10  (via drill 0.35)
  Top 0.152: IC1.25 95.33,84.27 v95.26,84.34 | v100.82,84.34 100.76,84.41 U$1.17
  Bottom 0.152: v95.26,84.34 v100.82,84.34
N$11
  Top 0.152: IC1.26 94.53,83.46 94.65,83.58 94.65,85.66 U$1.15
N$12  (via drill 0.35)
  Top 0.152: IC1.27 93.73,82.23 v93.82,82.33
  Bottom 0.152: v93.82,82.33 91.79,82.33 91.43,82.69 91.43,84.98 U$1.14
N$13
  Top 0.152: IC1.28 92.93,82.29 94.35,83.71 94.35,90.56 U$1.5
N$14  (via drill 0.35)
  Top 0.152: IC1.29 92.13,83.4 v92.19,83.45 | v97.01,83.45 97.01,90.82 96.06,91.77 U$1.4
  Bottom 0.152: v92.19,83.45 v97.01,83.45
N$15  (via drill 0.35)
  Top 0.152: IC1.30 91.33,83.61 91.93,84.22 v91.93,87.9 | v100.7,87.98 100.7,91.71 U$1.2
  Bottom 0.152: v91.93,87.9 100.62,87.9 v100.7,87.98
N$16  (via drill 0.35)
  Top 0.152: IC1.31 v90.53,84.59 v90.54,84.6 | v86.85,84.6 86.73,84.72 86.73,91.2 86.16,91.77 U$1.8
  Bottom 0.152: v90.54,84.6 v86.85,84.6
N$17  (via drill 0.35)
  Top 0.152: IC1.8 92.13,73.74 v92.18,73.79 | v86.22,78.88 86.22,85.99 U$1.11
  Bottom 0.152: v92.18,73.79 92.18,77.87 91.5,78.56 86.98,78.56 86.66,78.88 v86.22,78.88
N$18  (1 unrouted)
N$19  (1 unrouted)
N$20  (1 unrouted)
N$21  (1 unrouted)
N$22  (1 unrouted)
N$23  (1 unrouted)
N$24  (2 unrouted)
N$25
  Top 0.152: 103.84,51.45 A0.1
  Top 0.305: R13.2 103.68,51.61 A0.1 102.53,51.38 102.03,50.88 IC2.15
N$26
  Top 0.305: R14.2 103.91,57.92 A1.1 103.31,55.97 102.73,55.39 102.73,52.59 100.76,50.62 IC2.16
N$27
  Top 0.305: R15.2 103.79,62.59 A2.1 103.75,60.59 103.11,60.59 102.6,60.08 102.6,56.41 102.15,55.96 102.15,52.9 99.49,50.24 IC2.17
N$28
  Top 0.305: IC2.19 96.95,51.57 97.75,52.37 R16.1
N$29
  Top 0.305: IC2.20 95.68,54.47 97.62,56.41 99,56.41 R17.1
N$30
  Top 0.254: IC1.20 99.33,81.09 C1.1
N$31
  Top 0.305: IC1.17 99.33,72.18 99.87,72.72 R18.2
RM102-1
  Top 0.305: U$6.1 92.43,26.42 97.52,31.51 97.52,34.86 R11.2 96.12,36.21 93.14,39.19 IC2.7
RM102-2  (via drill 0.35)
  Top 0.305: U$6.2 94.37,27.21 98.92,31.76 v98.92,32.41 98.92,33.7 R12.2 | v94.47,38.88 94.41,38.94 IC2.8
  Bottom 0.305: v98.92,32.41 96.76,34.57 96.76,37.35 95.24,38.88 v94.47,38.88
RM103-1
  Top 0.152: IC2.1 86.18,39.35 86.18,39.28 86.31,39.15 86.38,39.15 86.6,38.93 86.6,35 R8.2 91.06,34.23 U$3.1
RM103-2
  Top 0.152: R9.2 87.62,37.38 | 87.62,37.38 91.56,37.38 U$3.2 | IC2.2 87.45,39.35 87.45,39.28 87.62,39.11 87.62,37.38
RM103-3  (via drill 0.35)
  Top 0.305: U$3.3 94.73,35.23 94.73,36.96 92.81,38.88 89.52,38.88 | IC2.3 88.06,39.45 88.63,38.88 89.52,38.88 | R10.2 89.12,31.15 v89.14,31.13 | v89.62,38.84 89.55,38.84 89.52,38.88
  Bottom 0.305: v89.14,31.13 89.14,38.36 v89.62,38.84
RM107-1  (via drill 0.35)
  Top 0.305: U$2.1 96.57,57.23 v97.69,58.34 98.28,58.94 R1.2 | IC2.22 93.14,50.62 v93.08,50.69
  Bottom 0.305: v93.08,50.69 93.08,52.58 97.09,56.59 97.09,56.61 97.69,57.2 v97.69,58.34
RM107-2  (via drill 0.35)
  Top 0.305: U$2.2 98.67,61.74 R2.2 | IC2.23 91.87,50.75 v91.81,50.81
  Bottom 0.305: v91.81,50.81 91.81,51.96 96.63,56.78 96.63,58.31 U$2.2
RM107-3  (via drill 0.35)
  Top 0.305: U$2.3 98.67,64.28 R3.2 | IC2.24 90.6,50.62 90.54,50.69 v90.54,50.81
  Bottom 0.305: v90.54,50.81 89.78,51.58 89.78,63.39 90.16,63.77 93.71,63.77 95.17,62.31 U$2.3
RM107-4  (via drill 0.35)
  Top 0.305: R4.2 v89.27,64.28 92.95,64.28 93.39,63.83 U$2.4 | IC2.25 89.33,50.75 v89.27,50.81
  Bottom 0.305: v89.27,50.81 v89.27,64.28
RM107-5  (via drill 0.35)
  Top 0.305: U$2.5 90.54,61.74 R5.2 87.68,60.72 v88,60.4 | IC2.26 88.06,50.75 v88.12,50.81
  Bottom 0.305: v88.12,50.81 88,50.94 v88,60.4
RM107-6  (via drill 0.35)
  Top 0.305: U$2.6 90.79,59.07 R6.2 87.74,59 87.74,57.8 v86.73,57.8 | IC2.27 86.79,50.75 v86.73,50.81
  Bottom 0.305: v86.73,50.81 v86.73,57.8
RM107-7  (via drill 0.35)
  Top 0.305: U$2.7 90.79,56.4 R7.2 87.68,55.19 87.56,55.07 v85.62,55.07 | IC2.28 85.52,50.88 v85.58,50.94
  Bottom 0.305: v85.58,50.94 85.58,55.03 v85.62,55.07
RXD  (1 unrouted)
SCK  (1 unrouted)
SCL  (1 unrouted)
SDA  (1 unrouted)
TXD  (1 unrouted)
UART_RX  (1 unrouted)
UART_TX  (1 unrouted)

### Text on the board
tPlace: RM107 | RM103 | COLUMN | 5 | 4 | 3 | 2 | 1 | 4 | 3 | 2 | 1 | ROW | RM102